# Altium schematic sheet RGB_attiny2313.SchDoc
size A4
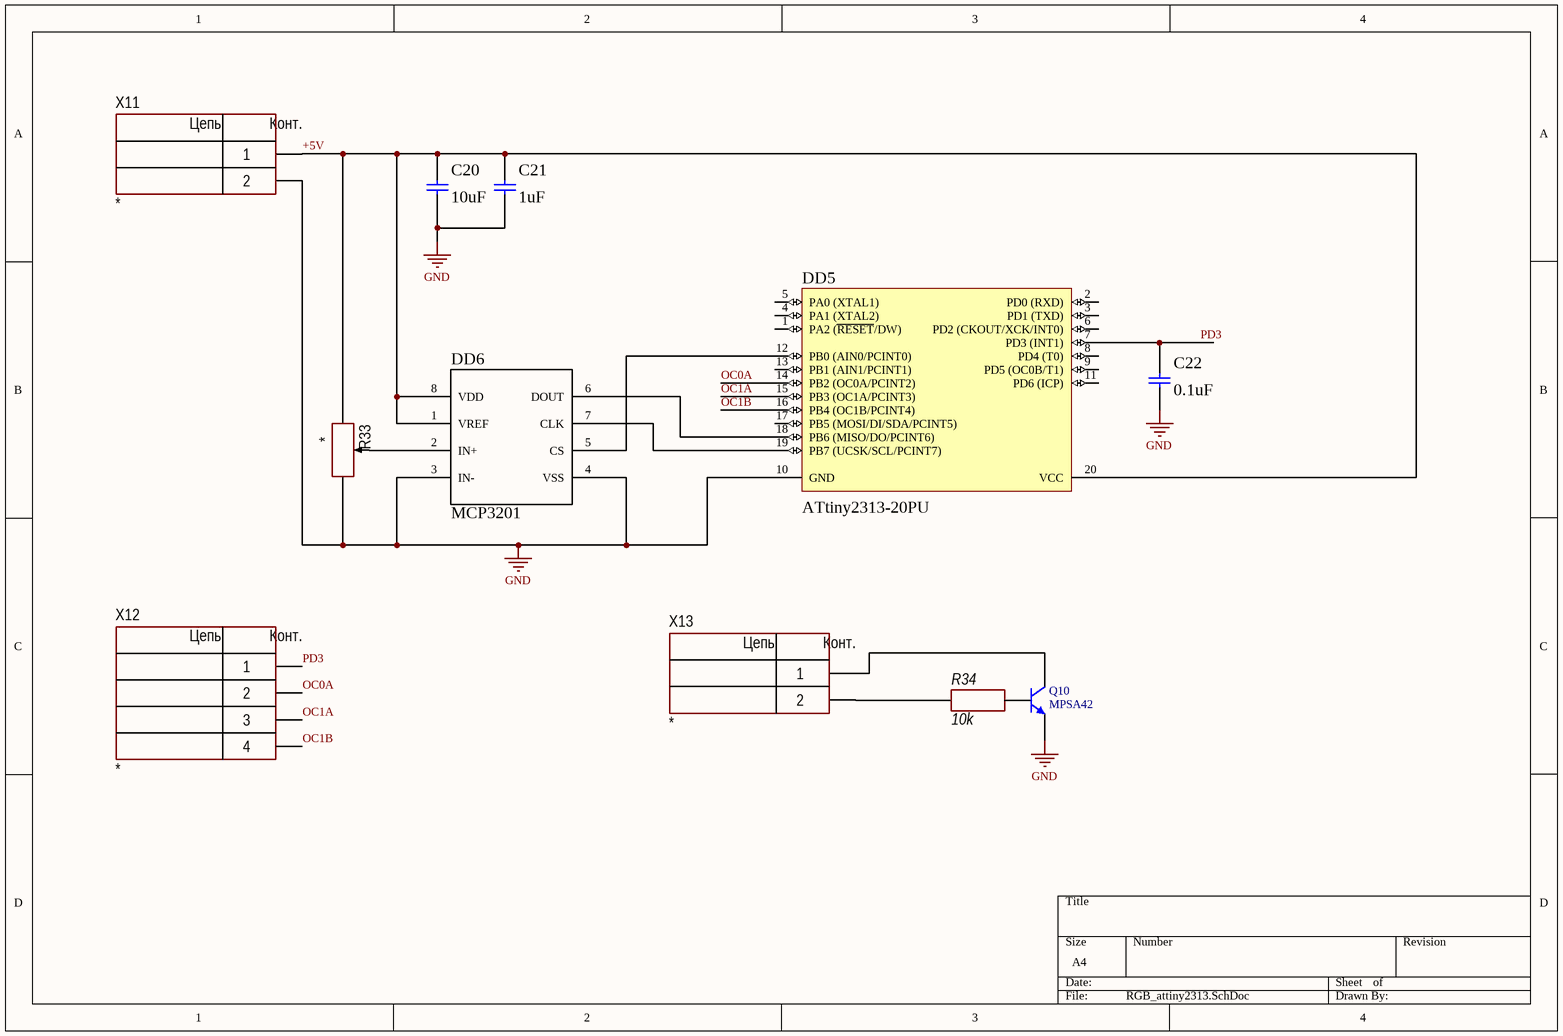
[diagram p0: RGB_attiny2313.SchDoc]

## Parts
C20  value 10uF  [C1206]  (hidden comment: Cap Semi)
C21  value 1uF  [C1206]  (hidden comment: Cap Semi)
C22  value 0.1uF  [C1206]  (hidden comment: Cap Semi)
DD5  ATtiny2313-20PU  [20P3]
DD6  MCP3201  [MAX1771_DIP8 - duplicate]
Q10  MPSA42  [TO-92A]
R33  *  [RES: 3362P]
R34  10k  [MLT]
X11  *  [CON: WJ06-02P]
X12  *  [CON: PBS-4]
X13  *  [CON: PBS-2]

## Nets
GND: C20.1 C21.1 C22.1 DD5.10(GND) DD6.3(IN-) DD6.4(VSS) Q10.1(E) R33.3 X11.2
+5V: C20.2 C21.2 DD5.20(VCC) DD6.1(VREF) DD6.8(VDD) R33.1 X11.1
OC0A: DD5.14(PB2_(OC0A/PCINT2)) X12.2
OC1A: DD5.15(PB3_(OC1A/PCINT3)) X12.3
OC1B: DD5.16(PB4_(OC1B/PCINT4)) X12.4
PD3: C22.2 DD5.7(PD3_(INT1)) X12.1
NetDD5_12: DD5.12(PB0_(AIN0/PCINT0)) DD6.5(CS)
NetDD5_18: DD5.18(PB6_(MISO/DO/PCINT6)) DD6.6(DOUT)
NetDD5_19: DD5.19(PB7_(UCSK/SCL/PCINT7)) DD6.7(CLK)
NetDD6_2: DD6.2(IN+) R33.2
NetQ10_2: Q10.2(B) R34.1
NetQ10_3: Q10.3(C) X13.1
NetR34_2: R34.2 X13.2

Not connected (* = marked no-connect by the designer): DD5 1(PA2_(~{RESET}/DW)) 2(PD0_(RXD)) 3(PD1_(TXD)) 4(PA1_(XTAL2)) 5(PA0_(XTAL1)) 6(PD2_(CKOUT/XCK/INT0)) 8(PD4_(T0)) 9(PD5_(OC0B/T1)) 11(PD6_(ICP)) 13(PB1_(AIN1/PCINT1)) 17(PB5_(MOSI/DI/SDA/PCINT5))

## Notes on the sheet
- (in symbol 2-Connector) Цепь; Конт.
- (in symbol 4-Connector) Цепь; Конт.

## Library data of the parts
C20-C22 = Cap Semi: Capacitor (Semiconductor SIM Model); Published: 8-Jun-2000; LatestRevisionDate: 29-May-2009; LatestRevisionNote: IPC-7351 Footprint Added.; PackageReference: C1206; Publisher: Altium Limited; PackageDescription: Chip Capacitor
DD5 = ATtiny2313-20PU: Low Power tinyAVR® 8-Bit Microcontroller, 2K Flash Memory, 20MHz, Industrial Temperature, 20-Lead PDIP, Pb-Free; Published: 20-Nov-2009; DatasheetVersion: DOC2543B, Mar-2009; PackageVersion: revC, Jan-2004; PackageReference: 20P3; Publisher: Altium Limited; PackageDescription: 20-lead (0.300"/7.62mm Wide) Plastic Dual Inline Package (PDIP); Supplier 1: Digi-Key; Supplier Part Number 1: ATTINY2313-20PU-ND; Supplier 2: Farnell; Supplier Part Number 2: 9171592; Supplier 3: Mouser; Supplier Part Number 3: 556-ATTINY2313-20PU; Code_JEDEC: MS-001-AD; ComponentLink1Description: Manufacturer Link; ComponentLink1URL: http://www.atmel.com/products/AVR/tinyavr.asp?; ComponentLink2Description: Datasheet; ComponentLink2URL: http://www.atmel.com/dyn/resources/prod_documents/doc2543.pdf; ComponentLink3Description: Atmel.com Home; ComponentLink3URL: http://www.atmel.com
Q10 = 2N3904: NPN General Purpose Amplifier; Published: 8-Jun-2000; LatestRevisionDate: 15-Jan-2003; LatestRevisionNote: PCB Footprint 'BCY-W3/D4.7' replaced; DatasheetVersion: 1997; PackageVersion: Sep-1998; PackageReference: TO-92A; Publisher: Altium Limited; PackageDescription: TO, Flat Index; 3 In-Line, Axial Leads; Body Dia. 4.5mm; Leads 0.51 x 0.48 mm (max); ComponentLink1Description: Manufacturer Link; ComponentLink1URL: http://www.fairchildsemi.com/; ComponentLink2Description: Datasheet; ComponentLink2URL: http://www.fairchildsemi.com/ds/2N%2F2N3904.pdf
R33 = ADJ resistor: Manufacturer: *; Model: *; HelpURL: *; ComponentKind: *; Value: *
R34 = Resistor: MLT; Model: *; Manufacture: *; HelpURL: *; Case: *; Value: *
X11 X13 = 2-Connector: Model: *; Manufacturer: *; HelpURL: *; ComponentKind: *
X12 = 4-Connector: Model: *; Manufacturer: *; HelpURL: *; ComponentKind: *